# EAGLE design ESP8266-RGBW-S-R (EAGLE 9.6.2)
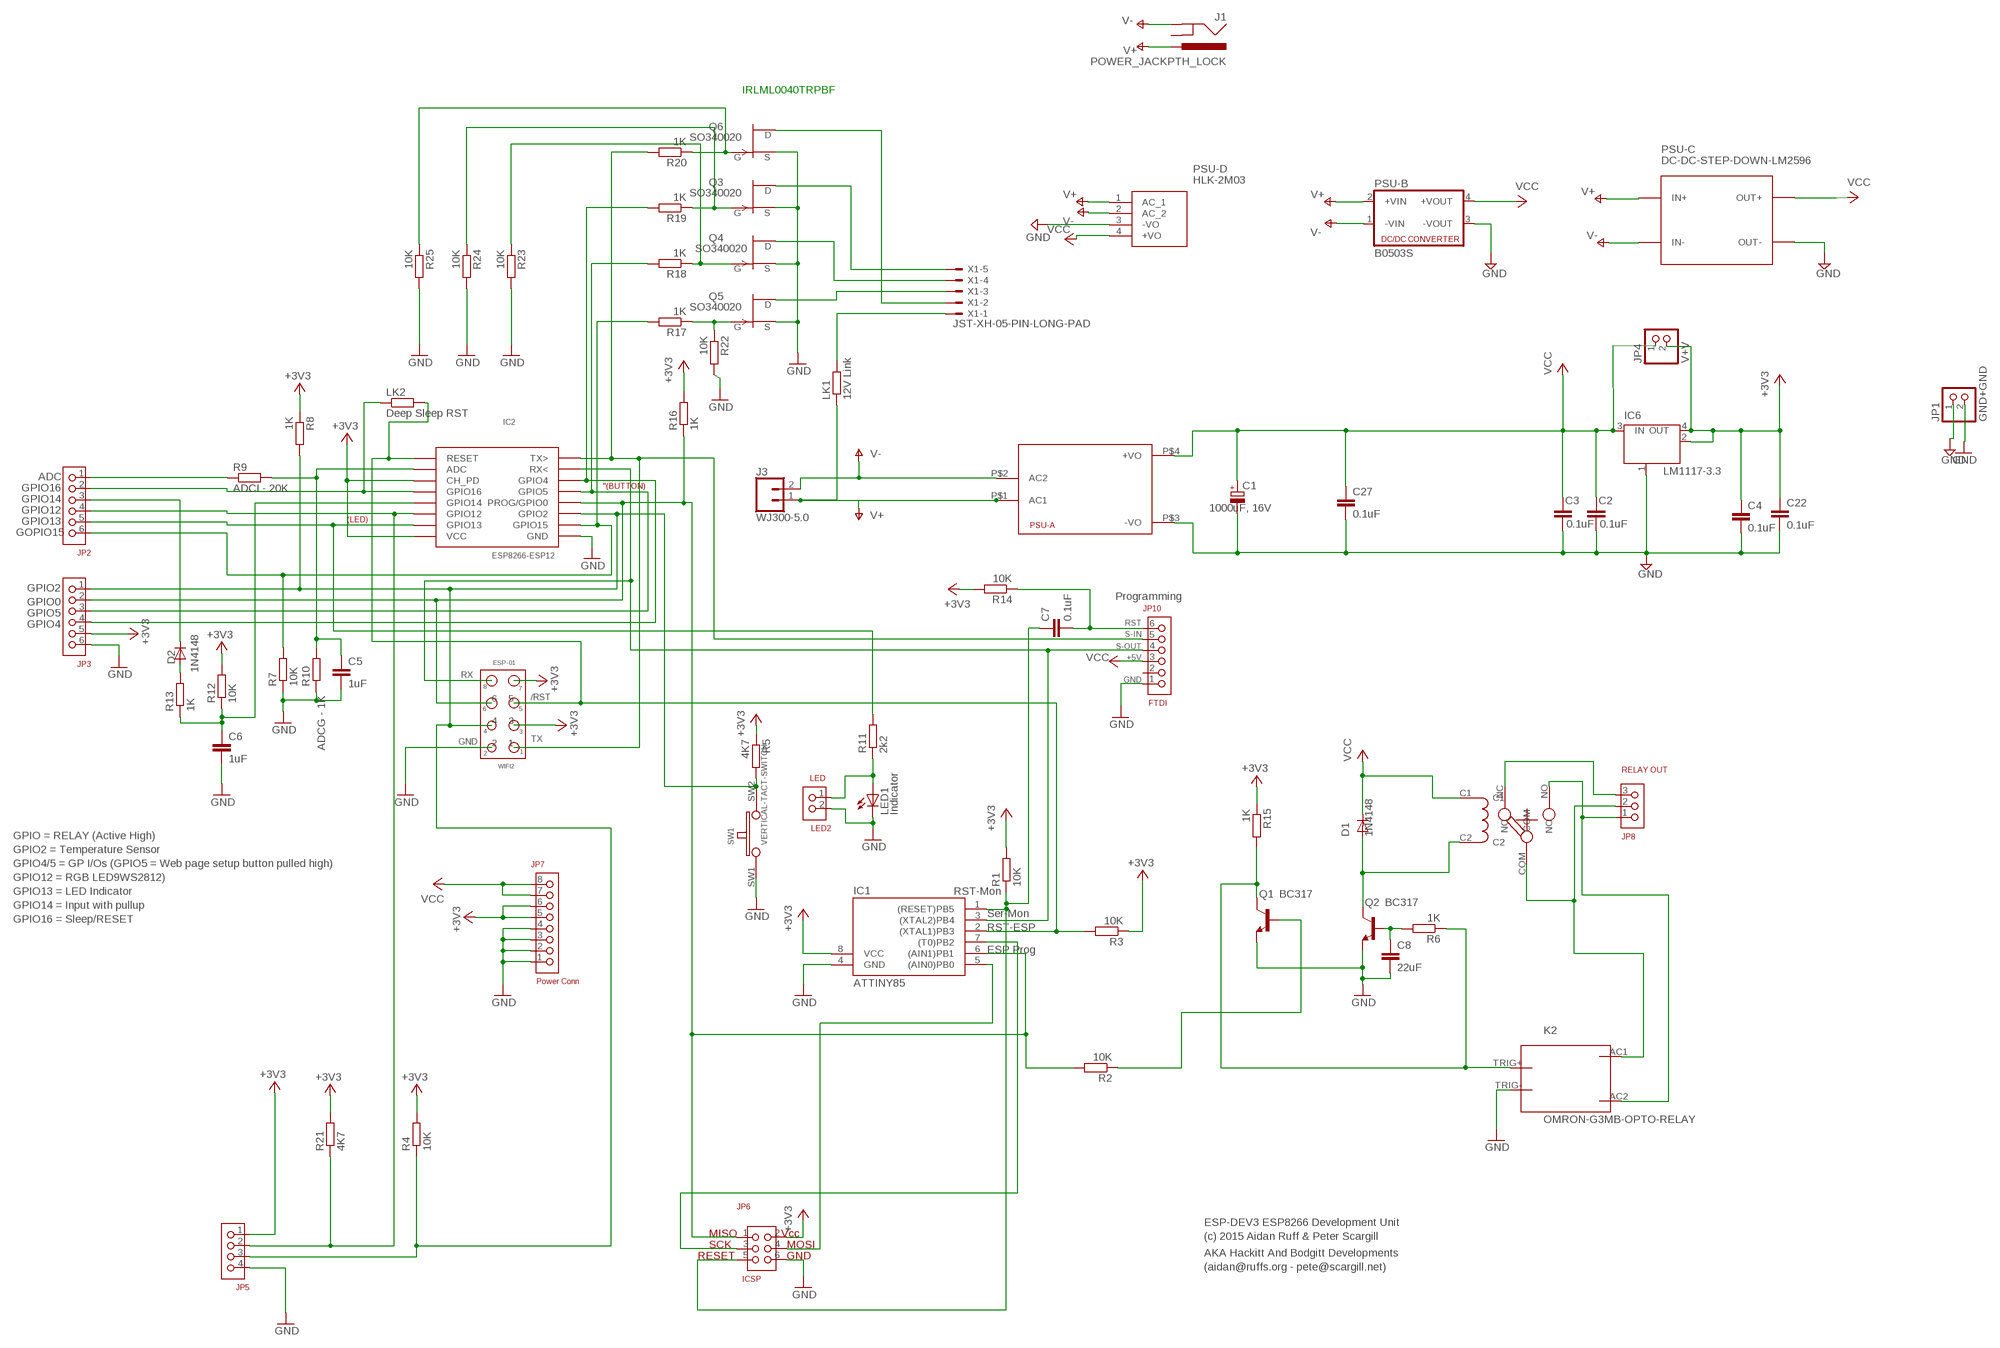
[diagram p0: schematic, sheet 1]

## Parts
C1  1000uF, 16V  CPOL-EU150CLZ-1010  [150CLZ-1010]
C2  0.1uF  C-EUC0805  [C0805]
C3  0.1uF  C-EUC0805  [C0805]
C4  0.1uF  C-EUC0805  [C0805]
C5  1uF  C-EUC0805  [C0805]
C6  1uF  C-EUC0805  [C0805]
C7  0.1uF  C-EUC0805  [C0805]
C8  22uF  C-EUC0805  [C0805]
C22  0.1uF  C-EUC0805  [C0805]
C27  0.1uF  C-EUC0805  [C0805]
D1  1N4148  1N4148D0805  [D0805]
D2  1N4148  1N4148D0805  [D0805]
IC1  ATTINY85  TINY10S  [SOIC8]
IC2  ESP8266-ESP12  [ESP8266-ESP12A]
IC6  LM1117-3.3  MC33269ST-3.3T3  [SOT223]
J1  POWER_JACKPTH_LOCK  [POWER_JACK_PTH_LOCK]
J3  WJ300-5.0  CONN_02PTH4  [1X02_XTRA_BIG]
JP1  GND+GND  PINHD-1X2  [1X02]
JP2  HDR6X0.1  [HDR6X0.1]
JP3  HDR6X0.1  [HDR6X0.1]
JP4  V+V  PINHD-1X2  [1X02]
JP5  HDR4X0.1  [HDR4X0.1]
JP6  ICSP  HDR3X2X0.1  [HDR3X2X0.1]
JP7  Power Conn  HDR8X0.1  [HDR8X0.1]
JP8  RELAY OUT  3X0.2  [3X0.2]
JP10  FTDI  HDR6X0.1  [HDR6X0.1]
K1  SONGLE-RELAY-SPDT  [SONGLE-RELAY-SPDT]
K2  OMRON-G3MB-OPTO-RELAY  [OMRON-G3MB-OPTO-RELAY]
LED1  Indicator  LEDCHIP-LED0805  [CHIP-LED0805]
LED2  LED  HDR2X0.1  [HDR2X0.1]
LK1  12V Link  R-EU_R0805  [R0805]
LK2  Deep Sleep RST  R-EU_R0805  [R0805]
PSU-A  HLK-PM013W  [HLK-PM01]
PSU-B  B0503S  NME  [NME]
PSU-C  DC-DC-STEP-DOWN-LM2596  [DC-DC-STEP-DOWN-LM2596]
PSU-D  HLK-2M03  [HLK2M03]
Q1  BC317  BC808-NPN-SOT23-BEC  [SOT23-BEC]
Q2  BC317  BC808-NPN-SOT23-BEC  [SOT23-BEC]
Q3  SO340020  [SOT23]
Q4  SO340020  [SOT23]
Q5  SO340020  [SOT23]
Q6  SO340020  [SOT23]
R1  10K  R-EU_R0805  [R0805]
R2  10K  R-EU_R0805  [R0805]
R3  10K  R-EU_R0805  [R0805]
R4  10K  R-EU_R0805  [R0805]
R5  4K7  R-EU_R0805  [R0805]
R6  1K  R-EU_R0805  [R0805]
R7  10K  R-EU_R0805  [R0805]
R8  1K  R-EU_R0805  [R0805]
R9  ADCI - 20K  R-EU_R0805  [R0805]
R10  ADCG - 1K  R-EU_R0805  [R0805]
R11  2k2  R-EU_R0805  [R0805]
R12  10K  R-EU_R0805  [R0805]
R13  1K  R-EU_R0805  [R0805]
R14  10K  R-EU_R0805  [R0805]
R15  1K  R-EU_R0805  [R0805]
R16  1K  R-EU_R0805  [R0805]
R17  1K  R-EU_R0805  [R0805]
R18  1K  R-EU_R0805  [R0805]
R19  1K  R-EU_R0805  [R0805]
R20  1K  R-EU_R0805  [R0805]
R21  4K7  R-EU_R0805  [R0805]
R22  10K  R-EU_R0805  [R0805]
R23  10K  R-EU_R0805  [R0805]
R24  10K  R-EU_R0805  [R0805]
R25  10K  R-EU_R0805  [R0805]
SW1  VERTICAL-TACT-SWITCH  [VERTICAL-TACT-SWITCH]
WIFI2  ESP-01  4X2X0.1  [4X2X0.1]
X1  JST-XH-05-PIN-LONG-PAD  [JST-XH-05-PACKAGE-LONG-PAD]

## Nets
+3V3 [power]: C4.1 C22.1 IC1.8(VCC) IC2.CH_PD IC2.VCC IC6.2(OUT) IC6.4(OUT) JP3.5 JP4.2 JP5.1 JP6.2 JP7.5 JP7.6 R1.2 R3.1 R4.2 R5.1 R8.1 R12.2 R14.2 R15.1 R16.2 R21.2 WIFI2.3 WIFI2.7
+VCC [power]: C1.+ C2.1 C3.1 C27.1 D1.C IC6.3(IN) JP4.1 JP7.7 JP7.8 JP10.3 K1.C1 PSU-A.P$4(+VO) ; supply symbol labelled VCC
ADC: JP2.1 R9.1
GND: C1.- C2.2 C3.2 C4.2 C5.2 C6.2 C8.2 C22.2 C27.2 IC1.4(GND) IC2.GND IC6.1(GND/ADJ) JP1.1 JP1.2 JP3.6 JP5.4 JP6.6 JP7.1 JP7.2 JP7.3 JP7.4 JP10.1 K2.TRIG- LED1.C LED2.2 PSU-A.P$3(-VO) PSU-B.3(-VOUT) PSU-C.OUT- PSU-D.3(-VO) Q1.E Q2.E Q3.2(S) Q4.2(S) Q5.2(S) Q6.2(S) R7.1 R10.1 R22.2 R23.2 R24.2 R25.2 SW1.SW1 WIFI2.2
GPIO0: IC1.6((AIN1)PB1) IC2.PROG/GPIO0 JP3.2 JP6.1 R2.2 R16.1 WIFI2.6
GPIO2: IC2.GPIO2 JP3.1 JP5.3 R4.1 R5.2 R8.2 SW1.SW2 WIFI2.4
GPIO3: IC2.TXD(TX>) JP10.5 R20.2 WIFI2.1
GPIO4: IC2.GPIO4 JP3.4 R19.2
GPIO5: IC2.GPIO5 JP3.3 R18.2
GPIO13: IC2.GPIO13 JP2.5 R11.2
GPIO15: IC2.GPIO15 JP2.6 R7.2 R17.2
GPIO16: IC1.2((XTAL1)PB3) IC2.RESET LK2.2 R3.2 WIFI2.5
MOSI: IC1.5((AIN0)PB0) JP6.4
N$1: K2.TRIG+ Q1.C R6.1 R15.2
N$2: C5.1 IC2.ADC R9.2 R10.2
N$4: LED1.A LED2.1 R11.1
N$6: C6.1 IC2.GPIO14 R12.1 R13.1
N$7: D2.A R13.2
N$8: IC1.3((XTAL2)PB4) IC2.RXD(RX<) JP10.4 WIFI2.8
N$9: D2.C JP2.3
N$10: C7.2 JP10.6 R14.1
N$11: IC2.GPIO12 JP2.4 JP5.2 R21.1
N$12: Q6.3(D) X1.2
N$13: Q1.B R2.1
N$14: Q5.3(D) X1.3
N$26: JP8.2 K1.COM K2.AC1
N$27: JP8.1 K1.NO K2.AC2
N$28: JP8.3 K1.NC
N$29: D1.A K1.C2 Q2.C
N$32: C8.1 Q2.B R6.2
N$79: Q4.3(D) X1.4
N$80: LK1.2 X1.1
N$82: Q5.1(G) R17.1 R22.1
N$112: Q4.1(G) R18.1 R23.1
N$113: Q3.1(G) R19.1 R24.1
N$115: IC2.GPIO16 JP2.2 LK2.1
N$117: Q3.3(D) X1.5
N$118: Q6.1(G) R20.1 R25.1
RESET: C7.1 IC1.1((RESET)PB5) JP6.5 R1.1
SCLK: IC1.7((T0)PB2) JP6.3
V+: J1.PWR J3.1 LK1.1 PSU-A.P$1(AC1) PSU-B.2(+VIN) PSU-C.IN+ PSU-D.1(AC_1)
V-: J1.GND J3.2 PSU-A.P$2(AC2) PSU-B.1(-VIN) PSU-C.IN- PSU-D.2(AC_2)
VCC [power]: PSU-B.4(+VOUT) PSU-C.OUT+ PSU-D.4(+VO)
Unconnected: J1.GNDBREAK JP10.2

## Notes on the sheet
- IRLML0040TRPBF
- ADC
- "(BUTTON)
- GPIO16
- GPIO14
- GPIO12
- (LED)
- GPIO13
- GOPIO15
- GPIO2
- Programming
- GPIO0
- GPIO5
- GPIO4 | RST
- S-IN
- S-OUT
- +5V
- RX
- GND
- /RST
- TX
- GND
- GPIO = RELAY (Active High)
- GPIO2 = Temperature Sensor
- GPIO4/5 = GP I/Os (GPIO5 = Web page setup button pulled high)
- GPIO12 = RGB LED9WS2812)
- GPIO13 = LED Indicator | RST-Mon
- GPIO14 = Input with pullup
- Ser-Mon
- GPIO16 = Sleep/RESET
- RST-ESP
- ESP Prog
- ESP-DEV3 ESP8266 Development Unit
- MISO | Vcc | (c) 2015 Aidan Ruff & Peter Scargill
- SCK | MOSI
- RESET | GND | AKA Hackitt And Bodgitt Developments
- (aidan@ruffs.org - pete@scargill.net)

## Library data of the parts
C1 = resistor:CPOL-EU: POLARIZED CAPACITOR, European symbol
C2-C8 C22 C27 = resistor:C-EU: CAPACITOR, European symbol
D1 D2 = diode:1N4148: DIODE high speed (Philips)
IC1 = atmel:TINY10: MICROCONTROLLER 1 Kbytes ROM; OC_FARNELL: unknown; OC_NEWARK: unknown
IC2 = Aidans:ESP8266-ESP12
IC6 = linear:MC33269ST*: Adjustable Output Low Dropout Voltage Regulator 800 mA Source: http://www.onsemi.com/pub/Collateral/MC33269-D.PDF
J1 = SparkFun-Connectors:POWER_JACK: Power Jack Connector This is the standard 5.5mm barrel jack for power. The PTH is the most common, proven, reliable, footprint. The Slot footprint only works if the mill layer is transmitted to the PCB fab house so be warned. Here are the connectors we sell at SparkFun: DC Barrel Power Jack/Connector <https://www.sparkfun.com/products/119> (PRT-00119) DC Barrel Power Jack/Connector (SMD) <https://www.sparkfun.com/products/12748> (PRT-12748) DC Barrel Jack Adapter - Breadboard Compatible <https://www.sparkfun.com/products/10811> (PRT-10811) It is used on this SparkFun product (and many, many others): SparkFun RedBoard - Programmed with Arduino <https://www.sparkfun.com/products/12757> (DEV-12757) Also, if you need a mating power supply or connector, please check these out: Wall Adapter Power Supply - 9VDC 650mA <https://www.sparkfun.com/products/298> (TOL-00298) DC Barrel Jack Adapter - Male <https://www.sparkfun.com/products/10287> (PRT-10287); PROD_ID: CONN-08197; SF_ID: PRT-00119
J3 = SparkFun-Connectors-2pin:CONN_02: Multi connection point. Often used as Generic Header-pin footprint for 0.1 inch spaced/style header connections On any of the 0.1 inch spaced packages, you can populate with these: Break Away Headers - Straight <https://www.sparkfun.com/products/116> (PRT-00116) Break Away Male Headers - Right Angle <https://www.sparkfun.com/products/553> (PRT-00553) Female Headers <https://www.sparkfun.com/products/115> (PRT-00115) Break Away Headers - Machine Pin <https://www.sparkfun.com/products/117> (PRT-00117) Break Away Female Headers - Swiss Machine Pin <https://www.sparkfun.com/products/743> (PRT-00743) For SCREWTERMINALS and SPRING TERMINALS visit here: Screw Terimnals on SparkFun.com <https://www.sparkfun.com/search/results?term=Screw+Terminals> (5mm/3.5mm/2.54mm spacing) This device is also useful as a general connection point to wire up your design to another part of your project. Our various solder wires solder well into these plated through hole pads. Hook-Up Wire - Assortment (Stranded, 22 AWG) <https://www.sparkfun.com/products/11375> (PRT-11375) Hook-Up Wire - Assortment (Solid Core, 22 AWG) <https://www.sparkfun.com/products/11367> (PRT-11367) View the entire wire category on our website here <https://www.sparkfun.com/categories/141> Special notes: Molex polarized connector foot print use with: PRT-08233 with associated crimp pins and housings. 2.54_SCREWTERM for use with PRT-10571. 3.5mm Screw Terminal footprints for PRT-08084 5mm Screw Terminal footprints for use with PRT-08432
JP1 JP4 = pinhead:PINHD-1X2: PIN HEADER
JP2 JP3 JP10 = Aidans:HDR6X0.1
JP5 = Aidans:HDR4X0.1
JP6 = Aidans:HDR3X2X0.1
JP7 = Aidans:HDR8X0.1
JP8 = Aidans:3X0.2
K1 = Aidans:SONGLE-RELAY-SPDT
K2 = Aidans:OMRON-G3MB-OPTO-RELAY
LED1 = led:LED: LED OSRAM: - CHIPLED LG R971, LG N971, LY N971, LG Q971, LY Q971, LO R971, LY R971 LH N974, LH R974 LS Q976, LO Q976, LY Q976 LO Q996 - Hyper CHIPLED LW Q18S LB Q993, LB Q99A, LB R99A - SideLED LS A670, LO A670, LY A670, LG A670, LP A670 LB A673, LV A673, LT A673, LW A673 LH A674 LY A675 LS A676, LA A676, LO A676, LY A676, LW A676 LS A679, LY A679, LG A679 - Hyper Micro SIDELED® LS Y876, LA Y876, LO Y876, LY Y876 LT Y87S - SmartLED LW L88C, LW L88S LB L89C, LB L89S, LG L890 LS L89K, LO L89K, LY L89K LS L896, LA L896, LO L896, LY L896 - TOPLED LS T670, LO T670, LY T670, LG T670, LP T670 LSG T670, LSP T670, LSY T670, LOP T670, LYG T670 LG T671, LOG T671, LSG T671 LB T673, LV T673, LT T673, LW T673 LH T674 LS T676, LA T676, LO T676, LY T676, LB T676, LH T676, LSB T676, LW T676 LB T67C, LV T67C, LT T67C, LS T67K, LO T67K, LY T67K, LW E67C LS E67B, LA E67B, LO E67B, LY E67B, LB E67C, LV E67C, LT E67C LW T67C LS T679, LY T679, LG T679 LS T770, LO T770, LY T770, LG T770, LP T770 LB T773, LV T773, LT T773, LW T773 LH T774 LS E675, LA E675, LY E675, LS T675 LS T776, LA T776, LO T776, LY T776, LB T776 LHGB T686 LT T68C, LB T68C - Hyper Mini TOPLED® LB M676 - Mini TOPLED Santana® LG M470 LS M47K, LO M47K, LY M47K Source: http://www.osram.convergy.de LUXEON: - LUMILED® LXK2-PW12-R00, LXK2-PW12-S00, LXK2-PW14-U00, LXK2-PW14-V00 LXK2-PM12-R00, LXK2-PM12-S00, LXK2-PM14-U00 LXK2-PE12-Q00, LXK2-PE12-R00, LXK2-PE12-S00, LXK2-PE14-T00, LXK2-PE14-U00 LXK2-PB12-K00, LXK2-PB12-L00, LXK2-PB12-M00, LXK2-PB14-N00, LXK2-PB14-P00, LXK2-PB14-Q00 LXK2-PR12-L00, LXK2-PR12-M00, LXK2-PR14-Q00, LXK2-PR14-R00 LXK2-PD12-Q00, LXK2-PD12-R00, LXK2-PD12-S00 LXK2-PH12-R00, LXK2-PH12-S00 LXK2-PL12-P00, LXK2-PL12-Q00, LXK2-PL12-R00 Source: www.luxeon.com KINGBRIGHT: KA-3528ASYC Source: www.kingbright.com
LED2 = Aidans:HDR2X0.1
LK1 LK2 R1-R25 = resistor:R-EU_: RESISTOR, European symbol
PSU-A = 5:HLK-PM01: Hi-Link Power Supply HLK-PM01 3W Author: Ahmed Said <https://github.com/AhmedSaid/EAGLELibraries>
PSU-B = dc-dc-converter:NME: DC-DC CONVERTER; MF: C & D TECHNOLOGIES, INC; MPN: NME1205D; OC_FARNELL: 1021466; OC_NEWARK: 98B8198
PSU-C = diy-modules:DC-DC-STEP-DOWN-LM2596: DC/DC Step-Down Regulator based on LM2596-ADJ chip LM2596 datasheet available here: http://www.ti.com/lit/ds/symlink/lm2596.pdf Click here to find device on ebay.com <http://www.ebay.com/sch/lm2596+power+regulator>
PSU-D = HLK-2M03:HLK-2M03: Global universal input voltage (90 ~ 245Vac); Source: Datasheet <https://robu.in/wp-content/uploads/2020/02/1912111437_HI-LINK-HLK-2M03_C399249.pdf>; DESCRIPTION: Global universal input voltage (90 ~ 245Vac);; HEIGHT: 19mm; MANUFACTURER_NAME: Hi-Link; MANUFACTURER_PART_NUMBER: HLK-2M03
Q1 Q2 = transistor:*-NPN-: NPN Transistror BF959 corrected 2008.03.06
Q3-Q6 = transistor-fet:?20*: TEMIC / Siliconix N-Channel JFET Source: JFET-J201_Siliconix_data.pdf
SW1 = Aidans:VERTICAL-TACT-SWITCH
WIFI2 = Aidans:4X2X0.1
X1 = Rembrandt Electronics - JST XH Connectors v1-0:JST-XH-05-PIN: JST XH Connector 2 Pin Wire to board connector. Pitch: 2,54 mm, (0.100") Number of pins: 5 Created by Rembrandt Electronics www.rembrandtelectronics.com

## Net classes
0 Default: width 0.203 mm
1 power: width 0.5 mm, drill 0.5 mm

## Board
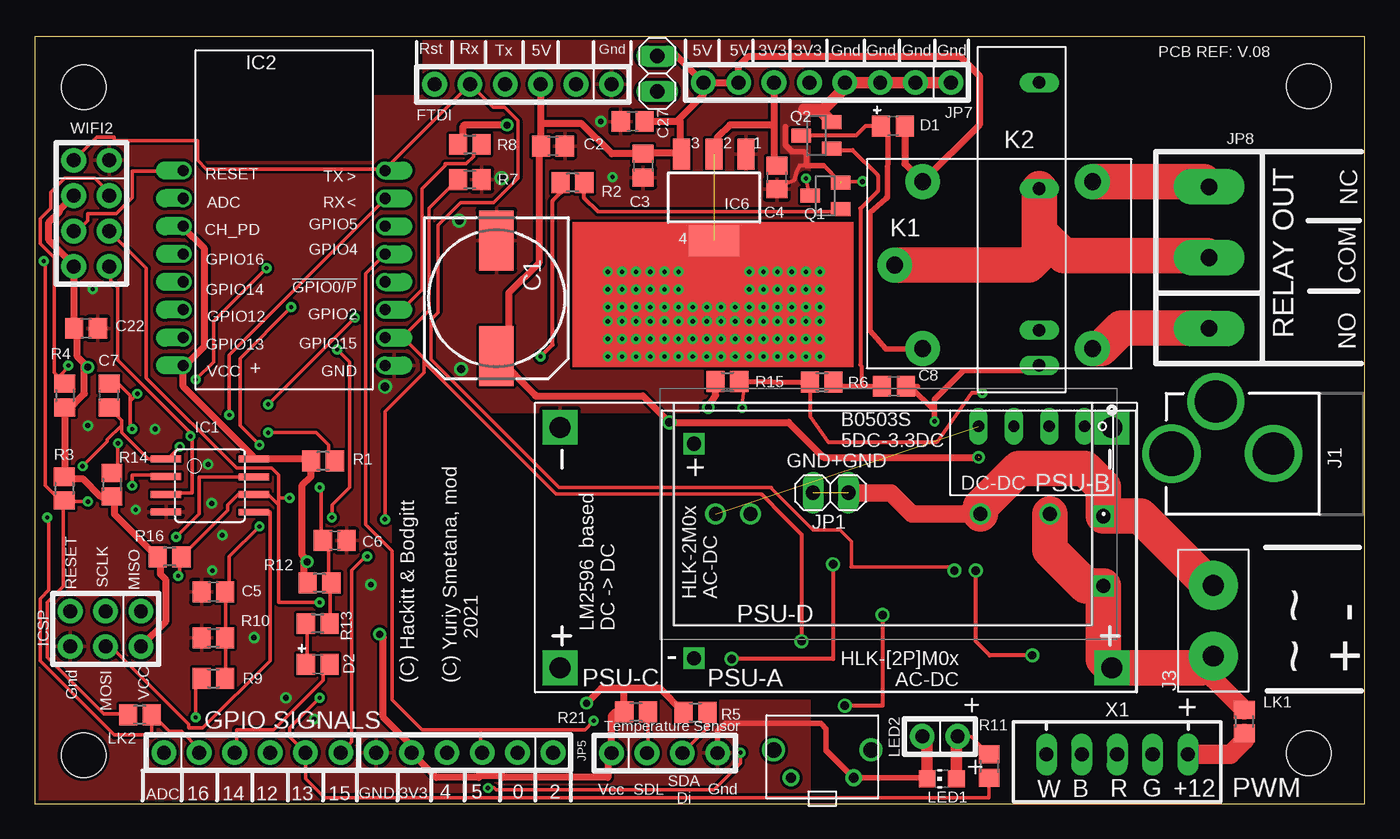
[diagram p1: board, top side]
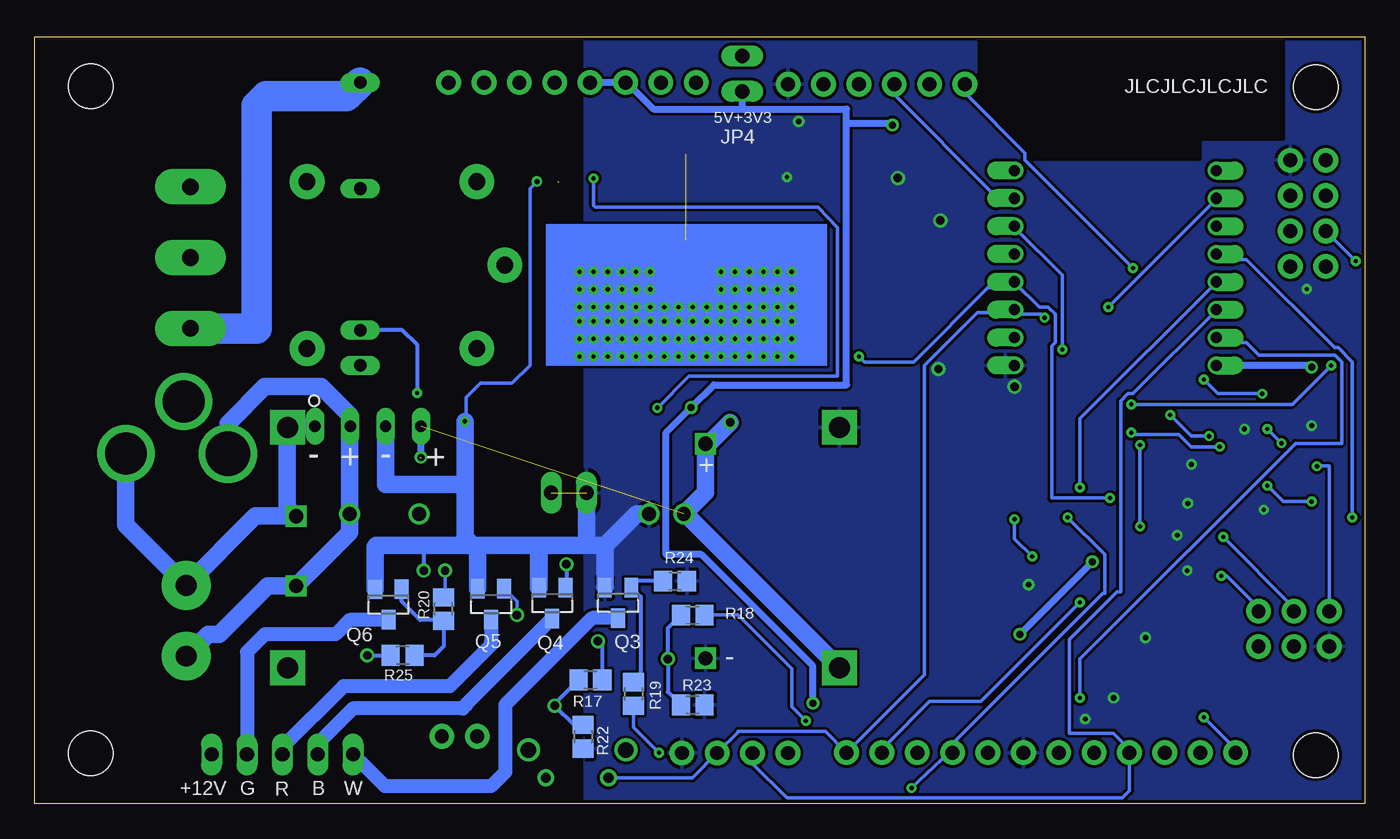
[diagram p2: board, bottom side, seen from below]

Size 95.5 x 55.1 mm. Coordinates in mm from the lower left corner, seen from the top.
Outline: 0,0 95.5,0 95.5,55.1 0,55.1 0,0
Copper layers (1*16): Top 0.035mm / dielectric 1.5mm / Bottom 0.035mm
Design rules "default *": minimum track width 10mil, minimum drill 12mil, track to track 8mil, track to pad 8mil, pad to pad 8mil, via to via 8mil, smd to smd 8mil, copper to edge 10mil, drill to drill 8mil, minimum pad ring 10mil, minimum via ring 8mil, stop-mask expansion 4mil, vias tented up to drill 0mil, thermal gap 10mil
Holes 3.2 mm at 3.5,51.47 3.5,3.5 91.48,3.65 91.48,51.57
tRestrict: area 59.3,31 to 77.3,46.6; area 5.8,47.8 to 24.3,54.9; area 24.3,51.1 to 27.7,54.9; area 55.9,0.2 to 82.7,54.9; area 34.2,7.6 to 68.6,27.9; area 25.8,7.6 to 34.2,27.9; area 83,-0.1 to 95.5,55.2
bRestrict: area 59.3,31 to 77.5,46.2; area 5.8,47.8 to 24.4,54.9; area 24.3,51.1 to 27.7,54.9; area 56.2,0.4 to 82.9,55.1

### Footprints (pad centres in the part's own frame; a part is rotated, then mirrored left to right if it is on the bottom)
150CLZ-1010 = smd 4.3 x 2.5: + 4.15,0; - -4.15,0
C0805 = smd 1.3 x 1.5: 1 -0.85,0; 2 0.85,0
D0805 = smd 1.3 x 1.5: A -0.85,0; C 0.85,0
SOIC8 = smd 0.5 x 2.2: 1 -1.905,-3.154; 2 -0.645,-3.154; 3 0.625,-3.154; 4 1.895,-3.154; 5 1.905,3.154; 6 0.635,3.154; 7 -0.635,3.154; 8 -1.905,3.154
ESP8266-ESP12A = drill 0.8 offset: ADC -7,4; CH_PD -7,2; GND 7.5,-8; GPIO2 7.5,-4; GPIO4 7.5,2; GPIO5 7.5,0; GPIO12 -7,-4; GPIO13 -7,-6; GPIO14 -7,-2; GPIO15 7.5,-6; GPIO16 -7,0; PROG/GPIO0 7.5,-2; RESET -7,6; RXD 7.5,4; TXD 7.5,6; VCC -7,-8
SOT223 = smd 1.219 x 2.235: 1 -2.311,-3.099; 2 0,-3.099; 3 2.311,-3.099 | smd 3.6 x 2.2: 4 0,3.099
POWER_JACK_PTH_LOCK = drill 2.997 pad 4.115: GND 0.025,6.557; GNDBREAK 3.762,10.7 | drill 3.2 pad 4.115: PWR 0,13.878
1X02_XTRA_BIG = drill 1.5 pad 3.5: 1 -2.54,0; 2 2.54,0
1X02 = drill 1.016 long: 1 -1.27,0; 2 1.27,0
HDR6X0.1 = drill 1 pad 1.778: 1 0,0; 2 0,2.54; 3 0,5.08; 4 0,7.62; 5 0,10.16; 6 0,12.7
HDR4X0.1 = drill 1 pad 1.778: 1 0,0; 2 0,2.54; 3 0,5.08; 4 0,7.62
HDR3X2X0.1 = drill 1 pad 1.778: 1 0,0; 2 2.54,0; 3 0,-2.54; 4 2.54,-2.54; 5 0,-5.08; 6 2.54,-5.08
HDR8X0.1 = drill 1 pad 1.778: 1 0,0; 2 0,2.54; 3 0,5.08; 4 0,7.62; 5 0,10.16; 6 0,12.7; 7 0,15.24; 8 0,17.78
3X0.2 = drill 1.2 pad 2.54 long: 1 0,0; 2 0,5.08; 3 0,10.16
SONGLE-RELAY-SPDT = drill 1.2 pad 2.5: C1 0,0; C2 12,0; COM 6,-2; NC 0,12.2; NO 12,12.2
OMRON-G3MB-OPTO-RELAY = drill 0.9 long: AC1 12.7,0; AC2 20.32,0; TRIG+ 2.54,0; TRIG- 0,0
CHIP-LED0805 = smd 1.2 x 1.2: A 0,-1.05; C 0,1.05
HDR2X0.1 = drill 1 pad 1.778: 1 0,0; 2 0,2.54
R0805 = smd 1.3 x 1.5: 1 -0.85,0; 2 0.85,0
HLK-PM01 = drill 1.016 square: P$1 -14.7,2.5; P$2 -14.7,-2.5; P$3 14.7,7.7; P$4 14.7,-7.7
NME = drill 0.813 long: 1 0,3.81; 2 0,1.27; 3 0,-1.27; 4 0,-3.81
DC-DC-STEP-DOWN-LM2596 = drill 1.5 pad 2.5 square: IN+ -19.812,8.636; IN- -19.812,-8.636; OUT+ 19.812,8.636; OUT- 19.812,-8.636
HLK2M03 = drill 1 pad 1.5: 1 0,0; 2 5,0; 3 21.5,0; 4 24,0
SOT23-BEC = smd 1 x 1.4: B -0.95,-1.1; C 0,1.1; E 0.95,-1.1
SOT23 = smd 1 x 1.4: 1 -0.95,-1.1; 2 0.95,-1.1; 3 0,1.1
VERTICAL-TACT-SWITCH = drill 1.1: P$3 0.5,2.5; P$4 7.5,2.5 | drill 0.7: SW1 1.75,4.5; SW2 6.25,4.5
4X2X0.1 = drill 1 pad 1.778: 1 -1.27,3.81; 2 1.27,3.81; 3 -1.27,1.27; 4 1.27,1.27; 5 -1.27,-1.27; 6 1.27,-1.27; 7 -1.27,-3.81; 8 1.27,-3.81
JST-XH-05-PACKAGE-LONG-PAD = drill 1.016 long: 1 -5.08,0; 2 -2.54,0; 3 0,0; 4 2.54,0; 5 5.08,0

### Placement (x,y rotation side)
C1  33.15,36.32 270 top
C2  37.21,47.24 0 top
C3  43.69,45.85 270 top
C4  53.29,45.01 270 top
C5  12.83,15.24 180 top
C6  21.54,18.92 0 top
C7  5.33,29.34 90 top
C8  61.7,30 0 top
C22  3.68,34.16 0 top
C27  42.93,49.02 180 top
D1  61.62,48.69 0 top
D2  20.32,10.03 0 top
IC1  12.57,22.86 270 top
IC2  17.65,39.5 0 top
IC6  48.77,43.56 180 top
J1  95.5,25.15 90 top
J3  84.63,13.16 90 top
JP1  57.15,22.35 180 top
JP2  9.27,3.68 270 top
JP3  37.21,3.68 90 top
JP4  44.7,52.45 270 top
JP5  41.42,3.66 270 top
JP6  7.62,13.84 270 top
JP7  65.79,51.82 90 top
JP8  84.33,34.16 0 top
JP10  41.4,51.69 90 top
K1  63.75,44.7 270 top
K2  72.14,31.5 90 top
LED1  65.13,1.8 90 top
LED2  66.27,4.85 90 top
LK1  86.84,5.92 270 top
LK2  7.54,6.4 180 top
PSU-A  62.04,18.17 180 top
PSU-B  71.58,27.13 270 top
PSU-C  57.53,18.41 180 top
PSU-D  72.9,20.83 180 top
Q1  56.77,43.69 90 top
Q2  56.13,48.01 90 top
Q3  53.62,14.45 180 bottom
Q4  58.34,14.43 180 bottom
Q5  62.74,14.35 180 bottom
Q6  70.1,14.33 180 bottom
R1  20.7,24.64 180 top
R2  38.61,44.63 180 top
R3  2.11,22.66 270 top
R4  2.16,29.34 270 top
R5  47.45,6.58 0 top
R6  56.52,30.3 0 top
R7  31.24,44.83 180 top
R8  31.24,47.37 0 top
R9  12.83,9.02 0 top
R10  12.83,11.94 0 top
R11  68.53,2.72 270 top
R12  20.45,15.88 180 top
R13  20.32,12.95 180 top
R14  5.54,22.94 270 top
R15  49.73,30.33 0 top
R16  9.68,17.75 180 top
R17  55.6,8.92 0 bottom
R18  48.26,13.56 0 bottom
R19  52.5,7.9 270 bottom
R20  66.14,14 90 bottom
R21  43.18,6.6 180 top
R22  56.13,4.83 270 bottom
R23  48.26,7.11 0 bottom
R24  49.53,16 0 bottom
R25  69.09,10.67 180 bottom
SW1  60.55,6.38 180 top
WIFI2  4.06,42.42 0 top
X1  77.72,3.56 180 top

### Tracks (layer width: path | path; a pad name or v marks a point on that pad's centre or on a via)
+3V3  (via drill 0.5)  (1 unrouted)
  Top 0.5: JP7.6 53.09,48.77 | 53.09,48.77 53.09,46.35 53.34,46.1 C4.1 | 53.09,48.77 49.91,48.77 49.02,47.88 49.02,46.99 48.77,46.74 IC6.2 | v48.36,28.47 48.36,28.54 48.9,29.34 R15.1 | 19.3,17.4 19.3,17.78 19.18,17.91 19.18,22.86 19.81,23.5 19.81,24.64 R1.2 19.68,24.77 IC1.8 15.62,24.89 15.62,25.02 10.67,29.97 10.67,31.5 IC2.VCC 10.79,31.5 12.19,32.89 12.19,39.88 10.67,41.4 IC2.CH_PD | 19.3,17.4 19.3,16.13 19.56,15.88 R12.2 | WIFI2.3 1.78,42.67 1.78,42.55 1.02,41.78 1.02,40.51 2.67,38.86 2.67,38.73 WIFI2.7 2.79,34.16 C22.1 3.05,34.04 3.05,32.13 3.56,31.62 3.56,31.37 | JP6.2 9.4,13.08 9.4,16.13 9.02,16.51 9.02,17.65 R16.2 8.76,17.78 5.71,20.83 5.71,21.97 R14.2 5.46,22.1 4.7,22.1 3.43,23.37 2.29,23.37 R3.1 2.16,23.62 R4.2 2.29,28.19 3.56,29.46 3.56,31.37 | v3.81,31.37 3.56,31.37 | v33.91,48.77 30.86,48.77 30.73,48.64 30.73,47.62 30.48,47.37 R8.1 | v24.77,12.19 25.02,11.94 25.02,6.22 26.92,4.32 26.92,3.81 JP3.5 28.83,1.91 31.88,1.91 31.88,2.03 33.58,2.03 33.58,1.91 41.15,1.91 41.15,2.92 41.4,3.17 41.4,3.43 JP5.1 41.42,6.37 41.66,6.6 R21.2 42.33,8.29 | v19.56,17.4 19.3,17.4 | 42.33,8.29 42.34,8.31 40.69,8.31 v39.62,7.24 | R5.1 44.88,8.29 42.33,8.29
  Top 0.508: v48.36,28.47 48.36,28.5
  Bottom 0.5: JP7.5 JP7.6 52.96,51.82 51.05,49.91 44.7,49.91 37.21,49.91 37.21,48.9 | v39.62,7.24 39.62,9.91 47.62,17.91 50.16,17.91 50.16,26.67 v48.36,28.47 46.74,30.1 37.21,30.1 37.21,48.9 | v3.81,31.37 3.94,31.5 10.54,31.5 IC2.VCC | v33.91,48.77 34.04,48.9 37.21,48.9 | v24.77,12.19 v19.56,17.4
  Bottom 0.508: JP4.2 44.7,49.91
+VCC  (via drill 0.5, 0.6)  (1 unrouted)
  Top 0.5: JP10.3 36.32,48.9 | 36.32,48.9 36.32,47.24 C2.1 36.2,47.12 36.2,38.86 34.04,36.7 34.04,33.15 33.27,32.38 C1.+ | 36.32,48.9 39.24,48.9 41.44,46.7 C3.1 43.69,46.74 46.35,46.74 IC6.3 46.35,46.86 46.35,49.02 C27.1 46.08,49.02 48.01,50.95 JP7.8 JP7.7 50.55,52.98 51.26,53.7 66.45,53.7 67.82,52.32 67.82,48.77 K1.C1 62.47,45.99 D1.C
  Top 0.508: 67.82,24.89 56.64,24.89 54.13,27.41 v45.57,27.41 43.66,29.31 35.94,29.31 35.94,29.38 C1.+ | JP4.1 46.1,53.72 JP7.8
  Bottom 0.508: 47.11,25.87 PSU-A.P$4 | v67.77,24.89 67.77,27.2
  Bottom 1.27: v45.57,27.41 47.11,25.87
ADC  (via drill 0.3)
  Top 0.254: v11.56,6.22 11.56,8.64 11.94,9.02 R9.1
  Bottom 0.254: v11.56,6.22 9.27,3.94 JP2.1
GND  (via drill 0.3, 0.35, 0.4, 0.6)  (2 unrouted)
  Top 0.254: v59.44,44.7 57.91,44.7
  Top 0.305: Q1.E 56.66,45.85 56.64,45.85 | 55.42,45.85 54.94,45.85 54.71,45.41 54.51,44.78 54.14,44.63 | v71.63,10.67 68.58,10.67 67.56,11.68 v67.56,16.76
  Top 0.406: 63.4,30 C8.2 62.85,30 64.6,28.25 64.6,27.5 v64.62,27.48 64.62,29.06 66.7,31.14 71.78,31.14 K2.TRIG- | JP5.4 49.04,5.25 49.58,5.79 56.44,5.79 56.82,5.41 56.82,3.86 SW1.SW1 64,1.88 LED1.C | Q2.E 56.51,49.68 54.94,49.68 | 53.9,48.64 53.9,47.32 54.38,46.84 55.24,46.84 55.42,46.66 55.42,45.85 56.64,45.85
  Top 0.813: Q2.E 56.3,49.89 55.24,49.89 55.27,49.86 56.59,49.86 58.17,51.44 JP7.4 JP7.3 JP7.2 JP7.1 | LED2.2 64.08,4.5 LED1.C
  Bottom 0.254: 54.61,15.59 Q3.2 | 63.75,15.52 Q5.2 | 59.18,15.64 Q4.2 | v59.44,44.7 59.94,44.2 59.94,31.5 61.21,30.23 63.5,30.23 64.52,29.21 64.52,27.43
  Bottom 0.305: v71.63,10.67 R25.2 | 67.56,18.55 v67.56,16.76
  Bottom 1.27: v64.62,27.48 64.62,22.94 | 64.62,22.94 70.31,22.94 PSU-B.3 | 64.62,22.94 64.62,19.15 64.02,18.55 | 70.96,18.57 70.98,18.55 | 55.88,18.57 59.31,18.57 59.31,15.54 Q4.2 59.29,18.57 63.6,18.57 63.69,18.48 | 55.88,18.57 54.58,18.57 54.57,18.56 | 63.69,18.48 63.76,18.55 64.02,18.55 | Q5.2 63.69,18.48 | 64.02,18.55 67.56,18.55 70.98,18.55 | 70.98,18.55 71.05,18.48 Q6.2 | Q3.2 54.57,18.56 | PSU-D.3 52.3,20.83 54.57,18.56 | JP1.2 55.88,18.57
  other vias: 41.48,45.03 4.17,36.98 12.75,16.76 7.24,21.13 30.48,41.91 33.53,44.96 25.15,29.97 30.61,31.24 15.75,11.94 18.03,7.62 24.13,15.75 40.64,49.02 20.07,6.1 13.46,19.3 8.64,26.92 3.81,27.18 12.45,24.38 12.7,21.59
  pour Top (isolate 0.127): 0.1,55.04 95.47,55.14 95.17,0 0,0.04
  pour Bottom (isolate 0.127): -0.1,55.08 95.52,55.08 95.61,0 0,0
GPIO0  (via drill 0.3)
  Top 0.254: v20.45,14.48 17.53,14.48 17.53,21.46 17.46,21.53 | 17.46,21.53 16.76,22.23 IC1.6 14.61,22.23 13.84,21.46 13.84,21.08 10.54,17.78 R16.1 10.41,17.65 10.41,16.51 v10.29,16.38 | WIFI2.6 8,38.48 8,30.61 14.48,24.13 17.02,24.13 17.53,23.62 17.53,21.97 | 17.53,21.97 17.53,21.59 17.46,21.53 | 17.53,21.97 v18.29,21.97
  Top 0.305: v36.32,32.13 37.19,32.99 37.19,43.33 37.76,43.91 R2.2
  Bottom 0.254: JP3.2 34.67,4.32 34.29,4.32 31.24,7.37 27.56,7.37 v20.45,14.48 | JP6.1 7.62,14.48 8,14.48 9.91,16.38 v10.29,16.38 | v18.29,21.97 22.48,21.97 22.48,32.89 22.23,33.15 22.23,35.18 22.73,35.69 23.37,35.69 25.15,37.47 IC2.PROG/GPIO0 25.27,37.47 25.65,37.08 27.05,37.08 32.38,31.75 35.81,31.75 35.94,31.75 v36.32,32.13
GPIO2  (via drill 0.3)
  Top 0.254: WIFI2.4 5.33,43.94 4.32,44.96 2.16,44.96 1.14,43.94 1.14,42.8 0.38,42.04 0.38,40.26 1.4,39.24 1.4,30.99 2.16,30.23 R4.1 1.78,30.73 2.41,31.37 v2.41,31.5 | R8.2 32,47.37 31.5,46.86 31.5,46.48 30.99,45.97 29.46,45.97 29.46,45.85 27.81,44.2 27.81,36.96 26.42,35.56 25.27,35.56 IC2.GPIO2 | v22.99,34.92 v16.76,28.7 | R5.2 48.3,5.46 JP5.3
  Bottom 0.254: 54.21,1.78 SW1.SW2 48.28,1.88 JP5.3 44.95,5.21 | 44.99,5.21 44.95,5.21 | 44.95,5.21 38.73,5.21 JP3.1 31.62,9.27 31.62,31.5 27.81,35.31 25.4,35.31 25.27,35.43 IC2.GPIO2 25.4,35.18 23.24,35.18 v22.99,34.92 | v2.41,31.5 5.21,28.7 v16.76,28.7
GPIO3  (via drill 0.6)
  Top 0.254: WIFI2.1 4.45,47.88 5.71,47.88 5.71,47.62 11.68,47.62 11.68,46.23 12.32,45.59 25.15,45.59 | 25.15,45.59 IC2.TXD | 25.15,45.59 JP10.5 32.89,50.04 33.75,50.04 34.69,49.09 34.69,44.94 32.93,43.18 30.57,43.18 28.96,41.56 28.96,35.31 28.45,34.8 28.45,31.93 37.64,22.73 52.83,22.73 | 52.91,22.73 52.83,22.73 | v66.04,16.76 65.79,17.02 58.62,17.02 58.65,17.04 58.65,18.87 57.84,19.68 55.88,19.68 52.83,22.73
  Bottom 0.254: R20.2 66.04,14.95 v66.04,16.76
GPIO4  (via drill 0.3)
  Top 0.254: v21.72,32.64 22.61,31.75 22.61,22.73 21.34,21.46 v21.34,20.57 | v50.67,3.68 50.67,2.92 48.77,1.02 33.12,1.02 32.99,1.14 v32.54,1.14
  Bottom 0.254: v21.72,32.64 21.72,37.97 25.15,41.4 IC2.GPIO4 | v21.34,20.57 18.67,17.91 18.67,15.11 18.8,15.11 29.59,4.32 JP3.4 29.84,3.68 v32.54,1.14 | R19.2 52.5,5.51 v50.67,3.68
GPIO5  (via drill 0.3)
  Top 0.254: 32,5.33 27.81,5.33 25.65,7.49 25.65,18.16 23.75,20.07 23.75,38.1 IC2.GPIO5 | 32,5.33 32,3.81 JP3.3 | v40.13,5.97 39.5,5.33 32,5.33
  Bottom 0.254: v40.13,5.97 41.12,6.96 41.12,9.7 45.01,13.59 47.38,13.59 R18.2
GPIO13  (via drill 0.3)
  Top 0.254: R11.2 68.53,0.46 20.8,0.46 19.46,1.8 19.46,3.66 JP2.5 18.29,4.83 18.29,5.46 v20.45,7.62
  Bottom 0.254: v20.45,7.62 20.45,10.41 4.95,25.91 1.65,25.91 1.65,31.75 2.16,32.26 7.62,32.26 8.51,33.15 10.29,33.15 10.54,33.4 IC2.GPIO13
GPIO15  (via drill 0.3, 0.6)
  Top 0.254: R7.2 30.35,44.83 28.32,42.8 28.32,35.43 26.42,33.53 25.27,33.53 IC2.GPIO15 26.54,33.53 26.54,33.4 27.94,32 27.94,31.75 | JP2.6 22.73,4.45 22.73,16.76 23.75,17.78 v23.88,17.78 | v25.15,20.45 25.15,28.19 27.94,30.99 27.94,31.75 | 52.17,22.25 37.44,22.25 27.94,31.75
  Top 0.305: v55.07,11.68 55.07,19.36 53.8,20.62 52.17,22.25
  Bottom 0.254: v25.15,20.45 25.15,19.05 v23.88,17.78
  Bottom 0.305: v55.07,11.68 54.75,11.37 R17.2
GPIO16  (via drill 0.3)
  Top 0.254: WIFI2.5 3.05,41.15 3.81,41.91 3.81,42.42 5.84,42.42 6.99,43.56 6.99,45.47 10.54,45.47 IC2.RESET | LK2.2 6.6,6.48 4.95,6.48 0.89,10.54 0.89,14.48 2.03,15.62 2.03,21.72 R3.2 | v6.99,22.86 6.99,23.62 9.4,23.62 IC1.2 | v3.81,21.72 2.16,21.72 R3.2 | v0.64,38.99 0.76,38.86 0.76,22.86 1.91,21.72 R3.2
  Bottom 0.254: v6.99,22.86 5.84,21.72 v3.81,21.72 | v0.64,38.99 WIFI2.5
MOSI
  Top 0.254: IC1.5 16.89,20.95 16.89,10.29 12.06,5.46 11.05,5.46 11.05,5.71 5.46,11.3 JP6.4
N$1  (via drill 0.3)
  Top 0.254: v55.37,44.93 55.63,43.69 Q1.C | v50.8,28.45 50.83,28.96 50.93,29.84 R15.2
  Top 0.305: R6.1 55.68,29.68 55.68,27.84 56.97,26.01 64.77,26.01 67.27,29.52 v68.05,29.52
  Top 0.406: R6.1 55.36,30.25 R15.2
  Bottom 0.254: v55.37,44.93 55.37,42.98 55.24,42.85 39.27,42.85 37.85,41.4 37.85,30.73 48.51,30.73 v50.8,28.45
  Bottom 0.305: v68.05,29.52 68.02,29.54 68.02,32.94 69.11,34.04 K2.TRIG+
N$2  (via drill 0.3)
  Top 0.254: 13.72,11.94 13.72,9.02 R9.2 | 13.72,11.94 13.72,15.24 | 13.72,11.94 R10.2 | v18.41,35.69 14.73,32 14.73,27.18 v16.13,25.78 | v16.13,19.94 13.97,17.78 13.97,15.49 13.72,15.24 | 13.72,15.24 C5.1
  Bottom 0.254: v18.41,35.69 10.67,43.43 IC2.ADC | v16.13,19.94 v16.13,25.78
N$4
  Top 0.254: R11.1 67.26,4.84 66.28,4.84
  Top 0.813: LED1.A 66.18,4.76 LED2.1 66.28,4.84
N$6  (via drill 0.3)
  Top 0.254: 21.21,15.88 21.21,12.95 R13.1 | 21.21,15.88 21.08,16 21.08,18.54 20.7,18.92 C6.1 20.57,18.92 20.57,22.61 v20.45,22.73 | 21.21,15.88 R12.1
  Bottom 0.254: v20.45,22.73 20.45,27.69 10.67,37.47 IC2.GPIO14
N$7
  Top 0.254: D2.A 19.56,10.03 19.56,12.95 R13.2
N$8  (via drill 0.3)
  Top 0.254: 11.24,26.61 5.97,31.88 5.97,37.08 5.46,37.59 5.46,38.48 WIFI2.8 | 11.24,26.61 11.3,26.54 11.3,22.35 9.53,22.35 IC1.3 | v13.97,27.94 13.97,32.26 25.15,43.43 IC2.RXD | v11.18,26.42 11.18,26.54 11.24,26.61
  Bottom 0.254: JP10.4 33.78,50.93 26.8,43.94 25.65,43.94 25.27,43.56 IC2.RXD | v13.97,27.94 12.45,26.42 v11.18,26.42
N$9
  Top 0.254: JP2.3 14.48,3.81 14.48,5.33 17.14,5.33 20.7,8.89 20.7,9.65 21.08,10.03 D2.C
N$10  (via drill 0.3)
  Top 0.254: v5.97,25.91 5.97,24.26 5.59,23.88 R14.1 | v6.99,26.92 6.86,27.05 6.86,28.96 | 6.86,28.96 6.86,29.34 5.97,30.23 5.33,30.23 C7.2 | v16.64,38.48 12.83,34.67 12.83,31.75 v11.56,30.48 | 6.86,28.96 v7.37,29.46
  Bottom 0.254: v6.99,26.92 v5.97,25.91 | JP10.6 28.7,50.93 28.57,50.93 24.38,46.74 24.38,46.23 v16.64,38.48 | v11.56,30.48 10.54,29.46 v7.37,29.46
N$11
  Top 0.254: R21.1 44.03,3.73 JP5.2
  Bottom 0.254: IC2.GPIO12 10.67,35.43 16.64,29.46 17.02,29.46 17.53,28.96 17.53,15.24 17.78,15.24 21.21,11.81 21.21,5.08 18.03,5.08 16.89,3.94 JP2.4 16.89,0.94 17.4,0.43 41.5,0.43 43.96,2.89 JP5.2
N$12
  Bottom 1.016: Q6.3 70.12,13.21 72.9,13.21 73.91,12.19 78.99,12.19 80.26,10.92 X1.2
N$13
  Top 0.305: Q1.B 57.7,42.52 40.44,42.55 39.46,43.52 R2.1
N$14
  Bottom 1.016: Q5.3 62.74,11.57 62.76,11.55 62.76,11.4 65.71,8.46 73.33,8.46 77.72,4.06 X1.3
N$15  (via drill 0.3)
  other vias: 53.34,32.13
N$16  (via drill 0.3)
  other vias: 54.36,32.13
N$17  (via drill 0.3)
  other vias: 55.37,32.13
N$18  (via drill 0.3)
  other vias: 56.39,32.13
N$19  (via drill 0.3)
  other vias: 56.39,33.4
N$20  (via drill 0.3)
  other vias: 55.37,33.4
N$21  (via drill 0.3)
  other vias: 54.36,33.4
N$22  (via drill 0.3)
  other vias: 53.34,33.4
N$23  (via drill 0.3)
  other vias: 53.34,34.67
N$24  (via drill 0.3)
  other vias: 54.36,34.67
N$25  (via drill 0.3)
  other vias: 55.37,34.67
N$26
  Top 2.54: JP8.2 84.2,39.37 75.59,39.37 73.89,39.37 72.14,41.12 K2.AC1 72.14,39.5 71.34,38.7 66.12,38.7 K1.COM
N$27
  Top 2.54: JP8.1 84.3,34.19 78.03,34.19 76.54,32.7 K1.NO
  Bottom 2.184: K2.AC2 73.13,50.83 78.89,50.83 79.58,50.14 79.55,34.16 JP8.1
N$28
  Top 2.54: JP8.3 83.95,44.7 K1.NC
N$29
  Top 0.305: D1.A 59.66,48.69 58.98,48.01 Q2.C
  Top 0.406: D1.A 61.27,48.19 61.24,43.59 61.13,43.48 59.97,42.48 59.97,34.01 60.68,33.19 61.14,32.66 63.71,32.66 K1.C2
N$30  (via drill 0.3)
  other vias: 56.39,34.67
N$31  (via drill 0.3)
  other vias: 49.28,32.13
N$32
  Top 0.305: Q2.B 57.33,46.97 58.73,46.97 60.53,45.16 60.53,44.02 59.28,42.77 59.28,31.55 59.36,31.47 59.36,30 | 59.41,30.06 59.41,30
  Top 0.406: R6.2 57.5,30 59.41,30 | 59.36,30 C8.1 59.47,30 59.41,30.06
N$33  (via drill 0.3)
  other vias: 50.29,32.13
N$34  (via drill 0.3)
  other vias: 51.31,32.13
N$35  (via drill 0.3)
  other vias: 52.32,32.13
N$36  (via drill 0.3)
  other vias: 52.32,33.4
N$37  (via drill 0.3)
  other vias: 51.31,33.4
N$38  (via drill 0.3)
  other vias: 50.29,33.4
N$39  (via drill 0.3)
  other vias: 49.28,33.4
N$40  (via drill 0.3)
  other vias: 49.28,34.67
N$41  (via drill 0.3)
  other vias: 44.2,38.23
N$42  (via drill 0.3)
  other vias: 43.18,38.23
N$43  (via drill 0.3)
  other vias: 42.16,38.23
N$44  (via drill 0.3)
  other vias: 50.29,34.67
N$45  (via drill 0.3)
  other vias: 42.16,36.96
N$46  (via drill 0.3)
  other vias: 43.18,36.96
N$47  (via drill 0.3)
  other vias: 51.31,34.67
N$48  (via drill 0.3)
  other vias: 44.2,36.96
N$49  (via drill 0.3)
  other vias: 42.16,35.69
N$50  (via drill 0.3)
  other vias: 43.18,35.69
N$51  (via drill 0.3)
  other vias: 52.32,34.67
N$52  (via drill 0.3)
  other vias: 45.21,32.13
N$53  (via drill 0.3)
  other vias: 46.23,32.13
N$54  (via drill 0.3)
  other vias: 47.24,32.13
N$55  (via drill 0.3)
  other vias: 48.26,32.13
N$56  (via drill 0.3)
  other vias: 48.26,33.4
N$57  (via drill 0.3)
  other vias: 47.24,33.4
N$58  (via drill 0.3)
  other vias: 46.23,33.4
N$59  (via drill 0.3)
  other vias: 45.21,33.4
N$60  (via drill 0.3)
  other vias: 45.21,34.67
N$61  (via drill 0.3)
  other vias: 46.23,34.67
N$62  (via drill 0.3)
  other vias: 47.24,34.67
N$63  (via drill 0.3)
  other vias: 48.26,34.67
N$64  (via drill 0.3)
  other vias: 41.15,32.13
N$65  (via drill 0.3)
  other vias: 42.16,32.13
N$66  (via drill 0.3)
  other vias: 43.18,32.13
N$67  (via drill 0.3)
  other vias: 44.2,32.13
N$68  (via drill 0.3)
  other vias: 44.2,33.4
N$69  (via drill 0.3)
  other vias: 43.18,33.4
N$70  (via drill 0.3)
  other vias: 42.16,33.4
N$71  (via drill 0.3)
  other vias: 41.15,33.4
N$72  (via drill 0.3)
  other vias: 41.15,34.67
N$73  (via drill 0.3)
  other vias: 42.16,34.67
N$74  (via drill 0.3)
  other vias: 43.18,34.67
N$75  (via drill 0.3)
  other vias: 44.2,34.67
N$76  (via drill 0.3)
  other vias: 41.15,38.23
N$77  (via drill 0.3)
  other vias: 41.15,36.96
N$78  (via drill 0.3)
  other vias: 41.15,35.69
N$79
  Bottom 1.016: Q4.3 64.52,7.16 64.52,7.11 64.77,6.86 72.64,6.86 75.18,4.32 X1.4
N$80
  Top 1.4: LK1.2 86.84,4.56 85.84,3.56 X1.1
N$82  (via drill 0.6)
  Top 0.305: v60.88,13.56 60.88,7.06 v58.17,7.06
  Bottom 0.254: Q5.1 60.88,14.55 v60.88,13.56
  Bottom 0.305: R17.1 58.17,7.2 v58.17,7.06 56.78,5.68 R22.1
N$83  (via drill 0.3)
  other vias: 44.2,35.69
N$84  (via drill 0.3)
  other vias: 45.21,35.69
N$85  (via drill 0.3)
  other vias: 46.23,35.69
N$86  (via drill 0.3)
  other vias: 47.24,35.69
N$87  (via drill 0.3)
  other vias: 48.26,35.69
N$88  (via drill 0.3)
  other vias: 49.28,35.69
N$89  (via drill 0.3)
  other vias: 50.29,35.69
N$90  (via drill 0.3)
  other vias: 51.31,35.69
N$91  (via drill 0.3)
  other vias: 52.32,35.69
N$92  (via drill 0.3)
  other vias: 53.34,35.69
N$93  (via drill 0.3)
  other vias: 54.36,35.69
N$94  (via drill 0.3)
  other vias: 55.37,35.69
N$95  (via drill 0.3)
  other vias: 56.39,35.69
N$96  (via drill 0.3)
  other vias: 56.39,36.96
N$97  (via drill 0.3)
  other vias: 55.37,36.96
N$98  (via drill 0.3)
  other vias: 54.36,36.96
N$99  (via drill 0.3)
  other vias: 53.34,36.96
N$100  (via drill 0.3)
  other vias: 52.32,36.96
N$101  (via drill 0.3)
  other vias: 51.31,36.96
N$102  (via drill 0.3)
  other vias: 46.23,36.96
N$103  (via drill 0.3)
  other vias: 45.21,36.96
N$104  (via drill 0.3)
  other vias: 45.21,38.23
N$105  (via drill 0.3)
  other vias: 46.23,38.23
N$106  (via drill 0.3)
  other vias: 51.31,38.23
N$107  (via drill 0.3)
  other vias: 52.32,38.23
N$108  (via drill 0.3)
  other vias: 53.34,38.23
N$109  (via drill 0.3)
  other vias: 54.36,38.23
N$110  (via drill 0.3)
  other vias: 55.37,38.23
N$111  (via drill 0.3)
  other vias: 56.39,38.23
N$112  (via drill 0.6)
  Top 0.305: v57.33,17.22 57.33,10.41 v50.04,10.41
  Bottom 0.305: v57.33,17.22 57.33,15.59 Q4.1 | R18.1 50.04,12.64 v50.04,10.41 50.04,8.04 R23.1
N$113
  Bottom 0.305: R19.1 51.99,9.26 51.99,14.88 Q3.1 52.22,16 R24.1
N$115  (via drill 0.3)
  Top 0.254: JP2.2 11.81,3.94 10.54,5.21 9.65,5.21 8.51,6.35 LK2.1 8.38,6.35 8.38,4.95 5.71,4.95 0.38,10.29 0.38,14.73 1.02,15.37 1.02,20.45 v0.89,20.57
  Bottom 0.254: v0.89,20.57 0.89,31.75 1.91,32.77 2.16,32.77 8.51,39.12 10.16,39.12 10.54,39.5 IC2.GPIO16
N$117
  Bottom 1.016: Q3.3 55.48,13.35 61.72,7.11 61.72,2.29 62.74,1.27 70.36,1.27 X1.5
N$118
  Bottom 0.305: Q6.1 69.15,14.54 67.82,13.21 66.2,13.21 R20.1 66.14,11.33 66.8,10.67 R25.1
RESET  (via drill 0.3)
  Top 0.254: 6.22,27.18 6.22,26.67 8.13,24.77 IC1.1 9.53,24.77 v10.41,25.65 | 6.22,27.18 6.22,27.56 5.33,28.45 C7.1 | v16.76,26.67 20.19,26.67 21.08,25.78 21.08,25.02 21.46,24.64 R1.1 | v3.43,24.26 5.21,26.04 5.21,26.16 6.22,27.18
  Bottom 0.254: v16.76,26.67 16.64,26.54 13.34,26.54 12.45,25.65 v10.41,25.65 | JP6.5 2.54,24.26 v3.43,24.26
SCLK  (via drill 0.3)
  Top 0.254: IC1.7 11.81,23.5 11.81,20.83 v10.16,19.18
  Bottom 0.254: v10.16,19.18 5.08,14.1 JP6.3
V+
  Top 1.4: J3.1 84.63,8.98 LK1.1
  Top 2.54: J3.1 83.8,9.78 PSU-C.IN+ 76.74,10.38 PSU-A.P$1 75.47,15.67 72.9,18.24 PSU-D.1
  Bottom 1.27: J1.PWR 81.63,27.34 78.99,29.97 74.93,29.97 72.85,27.89 PSU-B.2 72.9,27.08 PSU-D.1 72.9,19.51 PSU-A.P$1 78.77,15.67 82.25,12.19 83.06,12.19 J3.1
V-
  Top 1.27: PSU-D.2 62.99,20.83 61.47,22.35 58.42,22.35
  Top 2.54: J3.2 84.38,15.7 79.41,20.67 PSU-A.P$2 76.74,22.78 75.41,24.11 70.67,24.11 67.9,21.34 PSU-D.2
  Bottom 1.27: PSU-B.1 77.27,27.13 PSU-C.IN- 77.37,27.03 77.37,21.29 76.75,20.67 PSU-A.P$2 79.66,20.67 J3.2 88.98,20.04 88.98,25.14 J1.GND
VCC  (1 unrouted)
  Bottom 1.27: PSU-C.OUT+ 48.77,20.83 PSU-D.4 47.35,22.38 47.35,25.91 47.37,25.93
(copper drawn outside any net)
  shapes: Bottom area x1, Top area x1

### Text on the board
tPlace: Rst | Rx | Tx | 5V | Gnd | 5V | 5V | 3V3 | 3V3 | Gnd | Gnd | Gnd | Gnd | PCB REF: V.08 | FTDI | NC | COM | NO | B0503S / 5DC-3.3DC | + | SCLK | MISO | RESET | ICSP | LM2596 based / DC -> DC | HLK-[2P]M0x / AC-DC | MOSI | VCC | - | (C) Hackitt & Bodgitt / / (C) Yuriy Smetana, mod / 2021 | ~ ~ / + - | Gnd | + | + | GPIO SIGNALS | Temperature Sensor | + | Vcc | SDL | Gnd | R | G | +12 | ADC | 16 | 14 | 12 | 13 | 15 | GND | 3V3 | 4 | 5 | 0 | 2 | SDA / Di | W | B | PWM
bPlace: JLCJLCJLCJLC | + | + | - | + | - | - | W | B | R | G | +12V
tNames: GND+GND | HLK-2M0x / AC-DC
bNames: 5V+3V3